# Altium schematic sheet Repeater.SchDoc
size A4; SheetNumber: 1; SheetTotal: 1
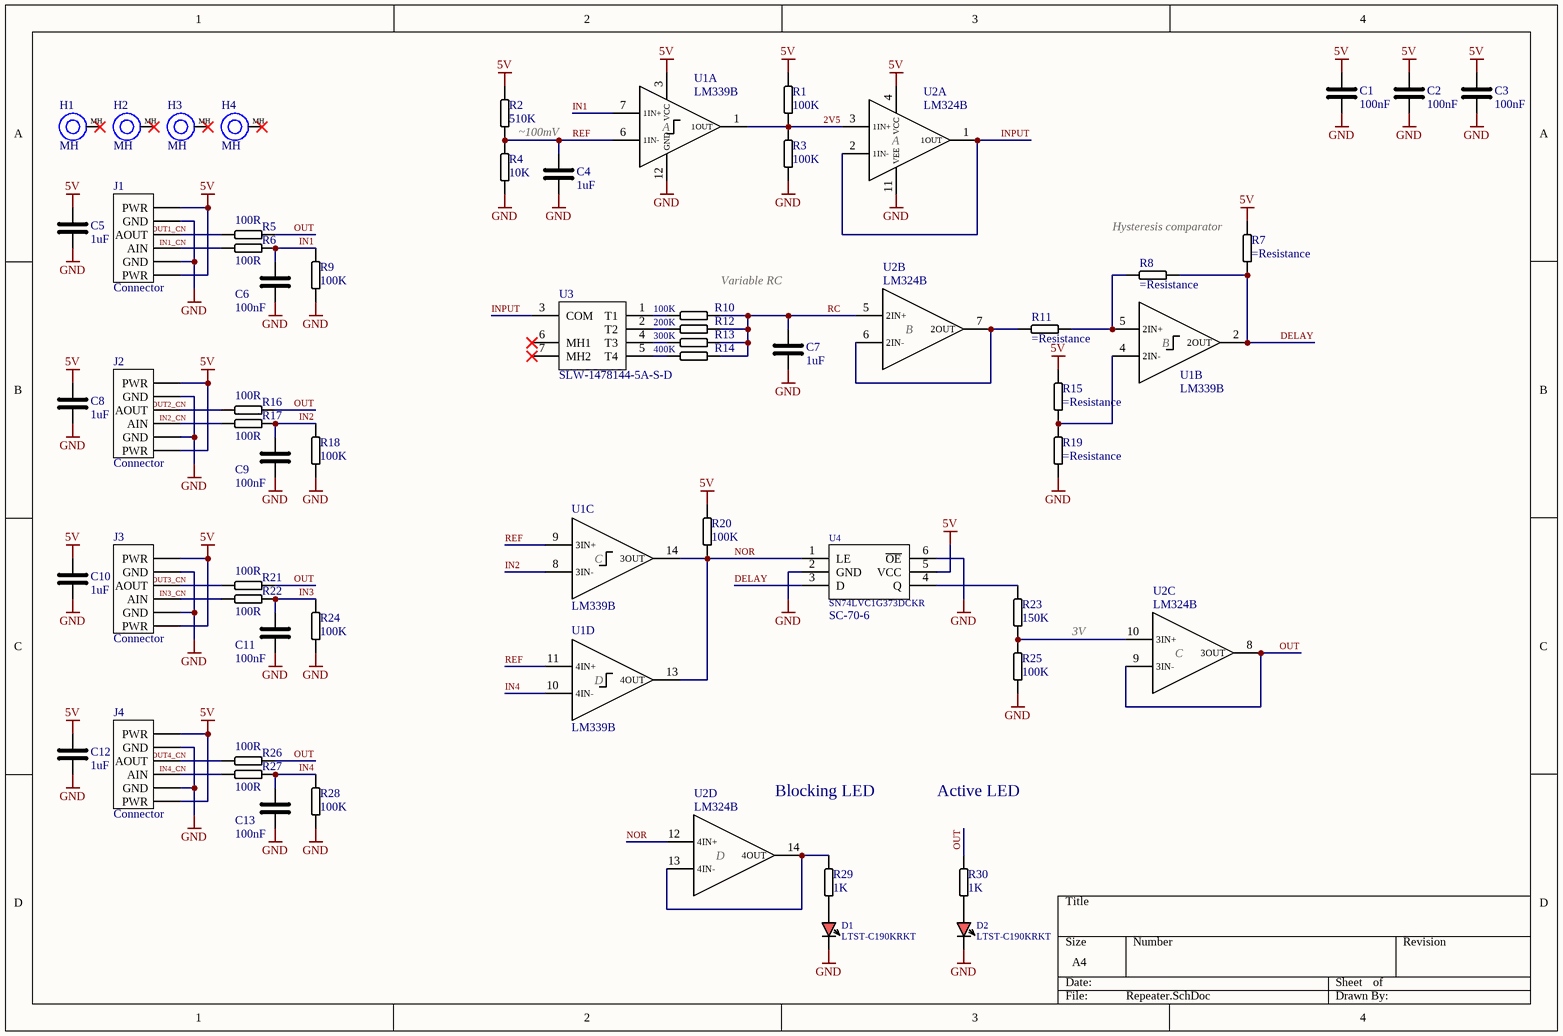
[diagram p0: Repeater.SchDoc]

## Parts
C1  100nF  [CAP0603]
C2  100nF  [CAP0603]
C3  100nF  [CAP0603]
C4  1uF  [CAP0603]
C5  1uF  [CAP0603]
C6  100nF  [CAP0603]
C7  1uF  [CAP0603]
C8  1uF  [CAP0603]
C9  100nF  [CAP0603]
C10  1uF  [CAP0603]
C11  100nF  [CAP0603]
C12  1uF  [CAP0603]
C13  100nF  [CAP0603]
D1  LTST-C190KRKT  [LED0603]
D2  LTST-C190KRKT  [LED0603]
H1  MH  [MOUNTING_HOLE_M2.5]
H2  MH  [MOUNTING_HOLE_M2.5]
H3  MH  [MOUNTING_HOLE_M2.5]
H4  MH  [MOUNTING_HOLE_M2.5]
J1  Connector  [CONNECTOR]
J2  Connector  [CONNECTOR]
J3  Connector  [CONNECTOR]
J4  Connector  [CONNECTOR]
R1  100K  [RES0603]
R2  510K  [RES0603]
R3  100K  [RES0603]
R4  10K  [RES0603]
R5  100R  [RES0603]
R6  100R  [RES0603]
R7  (no value)  [RES0603]
R8  (no value)  [RES0603]
R9  100K  [RES0603]
R10  100K  [RES0603]
R11  (no value)  [RES0603]
R12  200K  [RES0603]
R13  300K  [RES0603]
R14  400K  [RES0603]
R15  (no value)  [RES0603]
R16  100R  [RES0603]
R17  100R  [RES0603]
R18  100K  [RES0603]
R19  (no value)  [RES0603]
R20  100K  [RES0603]
R21  100R  [RES0603]
R22  100R  [RES0603]
R23  150K  [RES0603]
R24  100K  [RES0603]
R25  100K  [RES0603]
R26  100R  [RES0603]
R27  100R  [RES0603]
R28  100K  [RES0603]
R29  1K  [RES0603]
R30  1K  [RES0603]
U1  LM339B  [TSSOP_16P]  (parts A,B,C,D of 4)
U2  LM324B  [TSSOP_14P]  (parts A,B,C,D of 4)
U3  SLW-1478144-5A-S-D  [SOT-363-6]
U4  SN74LVC1G373DCKR  Package: SC-70-6  [SOT-363-6]

## Nets
5V: C1.1 C2.1 C3.1 C5.1 C8.1 C10.1 C12.1 J1.1(PWR) J1.6(PWR) J2.1(PWR) J2.6(PWR) J3.1(PWR) J3.6(PWR) J4.1(PWR) J4.6(PWR) R1.1 R2.2 R7.2 R15.2 R20.2 U1.3(VCC) U2.4(VCC) U4.5(VCC)
GND: C1.2 C2.2 C3.2 C4.2 C5.2 C6.2 C7.2 C8.2 C9.2 C10.2 C11.2 C12.2 C13.2 D1.C D2.C J1.2(GND) J1.5(GND) J2.2(GND) J2.5(GND) J3.2(GND) J3.5(GND) J4.2(GND) J4.5(GND) R3.2 R4.1 R9.2 R18.2 R19.1 R24.2 R25.1 R28.2 U1.12(GND) U2.11(VEE) U4.2(GND) U4.6(~{OE})
2V5: R1.2 R3.1 U1.1(1OUT) U2.3(1IN+)
DELAY: R7.1 R8.1 U1.2(2OUT) U4.3(D)
IN1: C6.1 R6.2 R9.1 U1.7(1IN+)
IN1_CN: J1.3(AIN) R6.1
IN2: C9.1 R17.2 R18.1 U1.8(3IN-)
IN2_CN: J2.3(AIN) R17.1
IN3: C11.1 R22.2 R24.1
IN3_CN: J3.3(AIN) R22.1
IN4: C13.1 R27.2 R28.1 U1.10(4IN-)
IN4_CN: J4.3(AIN) R27.1
INPUT: U2.1(1OUT) U2.2(1IN-) U3.3(COM)
NOR: R20.1 U1.13(4OUT) U1.14(3OUT) U2.12(4IN+) U4.1(LE)
OUT: R5.2 R16.2 R21.2 R26.2 R30.2 U2.8(3OUT) U2.9(3IN-)
OUT1_CN: J1.4(AOUT) R5.1
OUT2_CN: J2.4(AOUT) R16.1
OUT3_CN: J3.4(AOUT) R21.1
OUT4_CN: J4.4(AOUT) R26.1
RC: C7.1 R10.2 R12.2 R13.2 R14.2 U2.5(2IN+)
REF: C4.1 R2.1 R4.2 U1.6(1IN-) U1.9(3IN+) U1.11(4IN+)
NetD1_A: D1.A R29.1
NetD2_A: D2.A R30.1
NetR8_2: R8.2 R11.1 U1.5(2IN+)
NetR10_1: R10.1 U3.1(T1)
NetR11_2: R11.2 U2.6(2IN-) U2.7(2OUT)
NetR12_1: R12.1 U3.2(T2)
NetR13_1: R13.1 U3.4(T3)
NetR14_1: R14.1 U3.5(T4)
NetR15_1: R15.1 R19.2 U1.4(2IN-)
NetR23_1: R23.1 U4.4(Q)
NetR23_2: R23.2 R25.2 U2.10(3IN+)
NetR29_2: R29.2 U2.13(4IN-) U2.14(4OUT)

Not connected (* = marked no-connect by the designer): H1 MH*; H2 MH*; H3 MH*; H4 MH*; U3 6(MH1)* 7(MH2)*

## Notes on the sheet
- ~100mV
- (near R7) Hysteresis comparator
- Variable RC
- 3V
- (near U2) Blocking LED
- Active LED
- (in symbol LM324BIPWR, part A) A
- (in symbol LM324BIPWR, part B) B
- (in symbol LM324BIPWR, part C) C
- (in symbol LM324BIPWR, part D) D
- (in symbol LM339BIPWR, part A) A
- (in symbol LM339BIPWR, part B) B
- (in symbol LM339BIPWR, part C) C
- (in symbol LM339BIPWR, part D) D

## Library data of the parts
C1-C13 = Capacitor
H1-H4 = MountingHole
R1-R30 = Resistor
U1 = LM339BIPWR: Supplier: Mouser; Supplier Part Number: 595-LM339BIPWR
U2 = LM324BIPWR: Supplier: Mouser; Supplier Part Number: 595-LM324BIPWR
U4 = SN74LVC1G373DCKR: Manufacturer: TI; Function: Latch; PartName: SN74LVC1G373DCKR; Supplier: Mouser; Supplier Part Number: 595-SN74LVC1G373DCKR
D1 D2 = LTST-C190KRKT: Supplier: Mouser; Supplier Part Number: 859-LTST-C190KRKT
U3 = SLW-1478144-5A-S-D: Supplier: Mouser; Supplier Part Number: 179-SLW14781445ASD